# Altium schematic sheet DigitalInclinometer.SchDoc
size A3; Organization: Altium Limited; Address1: L3, 12a Rodborough Rd; Address2: Frenchs Forest; Address3: NSW; Address4: Australia 2086
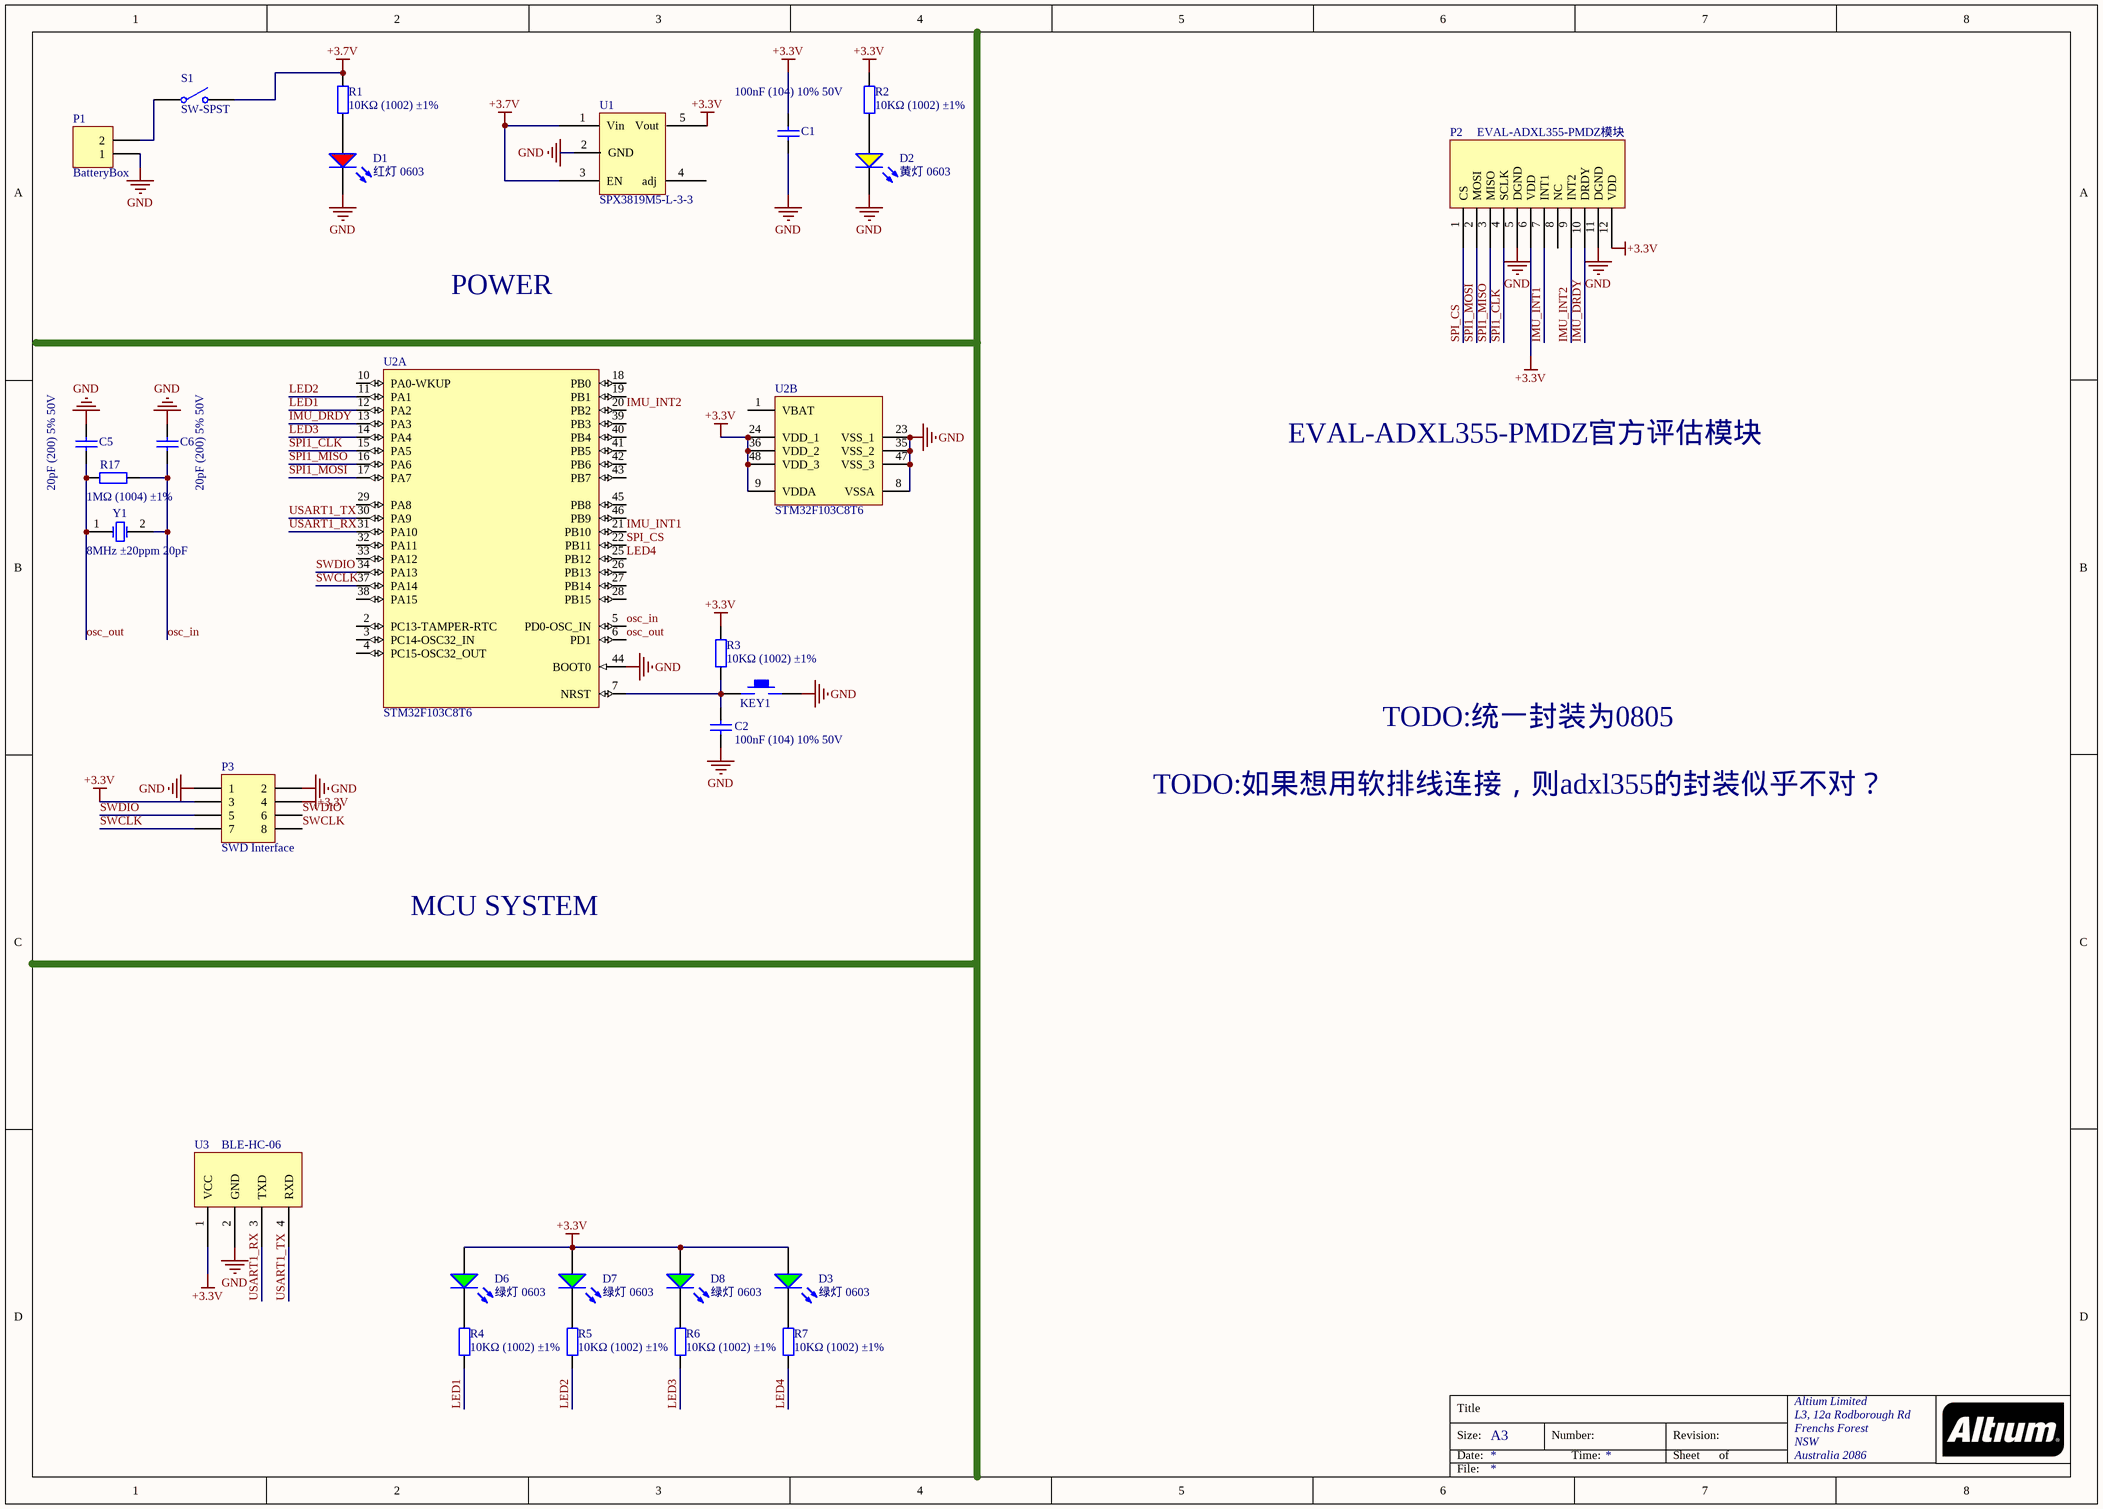
[diagram p0: DigitalInclinometer.SchDoc]

## Parts
C1  100nF (104) 10% 50V  [0603_C]
C2  100nF (104) 10% 50V  [0603_C]
C5  20pF (200) 5% 50V  [0603_C]
C6  20pF (200) 5% 50V  [0603_C]
D1  红灯 0603  [0603_LED_S1]
D2  黄灯 0603  [0603_LED_S1]
D3  绿灯 0603  [0603_LED_S1]
D6  绿灯 0603  [0603_LED_S1]
D7  绿灯 0603  [0603_LED_S1]
D8  绿灯 0603  [0603_LED_S1]
KEY1  KEY_M  [RESET-KEY-SMD]  (value not drawn)
P1  BatteryBox  [14500LiBatteryBox]
P2  EVAL-ADXL355-PMDZ模块  [ADXL355MODULE]
P3  SWD Interface  [2.54mmHeader2x4-SMD]
R1  10KΩ (1002) ±1%  [0603_R]
R2  10KΩ (1002) ±1%  [0603_R]
R3  10KΩ (1002) ±1%  [0603_R]
R4  10KΩ (1002) ±1%  [0603_R]
R5  10KΩ (1002) ±1%  [0603_R]
R6  10KΩ (1002) ±1%  [0603_R]
R7  10KΩ (1002) ±1%  [0603_R]
R17  1MΩ (1004) ±1%  [0603_R]
S1  SW-SPST  [PowerSwitcher]
U1  SPX3819M5-L-3-3  [SOT-23-5]
U2  STM32F103C8T6  [LQFP-48_7x7x05P]  (parts A,B of 2)
U3  BLE-HC-06  [BLE-HC06-SMD]
Y1  8MHz ±20ppm 20pF  [SMD-5032_2P]

## Nets
+3.3V: C1.2 D3.A D6.A D7.A D8.A P2.6(VDD) P2.12(VDD) P3.3 P3.4 R2.2 R3.2 U1.5(Vout) U2.9(VDDA) U2.24(VDD_1) U2.36(VDD_2) U2.48(VDD_3) U3.1(VCC)
+3.7V: R1.2 S1.2(NO) U1.1(Vin) U1.3(EN)
GND: C1.1 C2.1 C5.2 C6.2 D1.K D2.K KEY1.2 P1.1 P2.5(DGND) P2.11(DGND) P3.1 P3.2 U1.2(GND) U2.8(VSSA) U2.23(VSS_1) U2.35(VSS_2) U2.44(BOOT0) U2.47(VSS_3) U3.2(GND)
IMU_DRDY: P2.10(DRDY) U2.13(PA3)
IMU_INT1: P2.7(INT1) U2.21(PB10)
IMU_INT2: P2.9(INT2) U2.20(PB2)
LED1: R4.1 U2.12(PA2)
LED2: R5.1 U2.11(PA1)
LED3: R6.1 U2.14(PA4)
LED4: R7.1 U2.25(PB12)
osc_in: C6.1 R17.1 U2.5(PD0-OSC_IN) Y1.2(OSC2)
osc_out: C5.1 R17.2 U2.6(PD1) Y1.1(OSC1)
SPI1_CLK: P2.4(SCLK) U2.15(PA5)
SPI1_MISO: P2.3(MISO) U2.16(PA6)
SPI1_MOSI: P2.2(MOSI) U2.17(PA7)
SPI_CS: P2.1(CS) U2.22(PB11)
SWCLK: P3.7 P3.8 U2.37(PA14)
SWDIO: P3.5 P3.6 U2.34(PA13)
USART1_RX: U2.31(PA10) U3.3(TXD)
USART1_TX: U2.30(PA9) U3.4(RXD)
NetC2_2: C2.2 KEY1.1 R3.1 U2.7(NRST)
NetD1_A: D1.A R1.1
NetD2_A: D2.A R2.1
NetD3_K: D3.K R7.2
NetD6_K: D6.K R4.2
NetD7_K: D7.K R5.2
NetD8_K: D8.K R6.2
NetP1_2: P1.2 S1.1(COMMON)

Not connected (* = marked no-connect by the designer): P2 8(NC); U1 4(adj); U2 1(VBAT) 2(PC13-TAMPER-RTC) 3(PC14-OSC32_IN) 4(PC15-OSC32_OUT) 10(PA0-WKUP) 18(PB0) 19(PB1) 26(PB13) 27(PB14) 28(PB15) 29(PA8) 32(PA11) 33(PA12) 38(PA15) 39(PB3) 40(PB4) 41(PB5) 42(PB6) 43(PB7) 45(PB8) 46(PB9)

## Notes on the sheet
- POWER
- EVAL-ADXL355-PMDZ官方评估模块
- TODO:统一封装为0805
- TODO:如果想用软排线连接，则adxl355的封装似乎不对？
- MCU SYSTEM
- Title
- Size:
- Date:
- A3
- Number:
- Time:
- Revision:
- Sheet
- of
- File:

## Library data of the parts
C1 C2 = 0603 100nF (104) 10% 50V: 贴片电容; ComponentLink1Description: 供应商链接; ComponentLink1URL: http://www.szlcsc.com/product/details_15331.html; Package: 0603; Supplier: LC; SuppliersPartNumber: C14663
C5 C6 = 0603 20pF (200) 5% 50V: 贴片电容; ComponentLink1Description: 供应商链接; ComponentLink1URL: http://www.szlcsc.com/product/details_2000.html; Package: 0603; Supplier: LC; SuppliersPartNumber: C1648
D1 = 0603 红灯: 发光二极管; ComponentLink1Description: 供应商链接; ComponentLink1URL: http://www.szlcsc.com/product/details_2659.html; Package: 0603; Supplier: LC; SuppliersPartNumber: C2286
D2 = 0603 黄灯: 发光二极管; ComponentLink1Description: 供应商链接; ComponentLink1URL: http://www.szlcsc.com/product/details_73147.html; Package: 0603; Supplier: LC; SuppliersPartNumber: C72038
D3 D6-D8 = 0603 绿灯: 发光二极管; ComponentLink1Description: 供应商链接; ComponentLink1URL: http://www.szlcsc.com/product/details_73152.html; Package: 0603; Supplier: LC; SuppliersPartNumber: C72043
P1 = Header 2: Header, 2-Pin; LatestRevisionDate: 17-Jul-2002; LatestRevisionNote: Re-released for DXP Platform.; Publisher: Altium Limited
P3 = Header 4X2: Header, 4-Pin, Dual row; LatestRevisionDate: 17-Jul-2002; LatestRevisionNote: Re-released for DXP Platform.; Publisher: Altium Limited
R1-R7 = 0603 10KΩ (1002) 1%: 贴片电阻; ComponentLink1Description: 供应商链接; ComponentLink1URL: http://www.szlcsc.com/product/details_26547.html; Package: 0603; Supplier: LC; SuppliersPartNumber: C25804
R17 = 0603 1MΩ (1004) 1%: 贴片电阻; ComponentLink1Description: 供应商链接; ComponentLink1URL: http://www.szlcsc.com/product/details_23662.html; Package: 0603; Supplier: LC; SuppliersPartNumber: C22935
S1 = SW-SPST: Single-Pole, Single-Throw Switch; Published: 24-Mar-1999; LatestRevisionDate: 17-Jul-2002; LatestRevisionNote: Re-released for DXP Platform.; PackageReference: SPST-2; Publisher: Altium Limited; PackageDescription: Switch; 2 Leads
U2 = STM32F103C8T6: ARM; ComponentLink1Description: 供应商链接; ComponentLink1URL: http://www.szlcsc.com/product/details_9243.html; Package: LQFP-48_7x7x05P; Supplier: LC; SuppliersPartNumber: C8734
Y1 = SMD-5032_2P 8MHz 20ppm 20pF: 贴片晶振; ComponentLink1Description: 供应商链接; ComponentLink1URL: http://www.szlcsc.com/product/details_117214.html; Package: SMD-5032_2P; Supplier: LC; SuppliersPartNumber: C115962